# EAGLE design Circuit_Serial_3 (EAGLE 9.2.0)
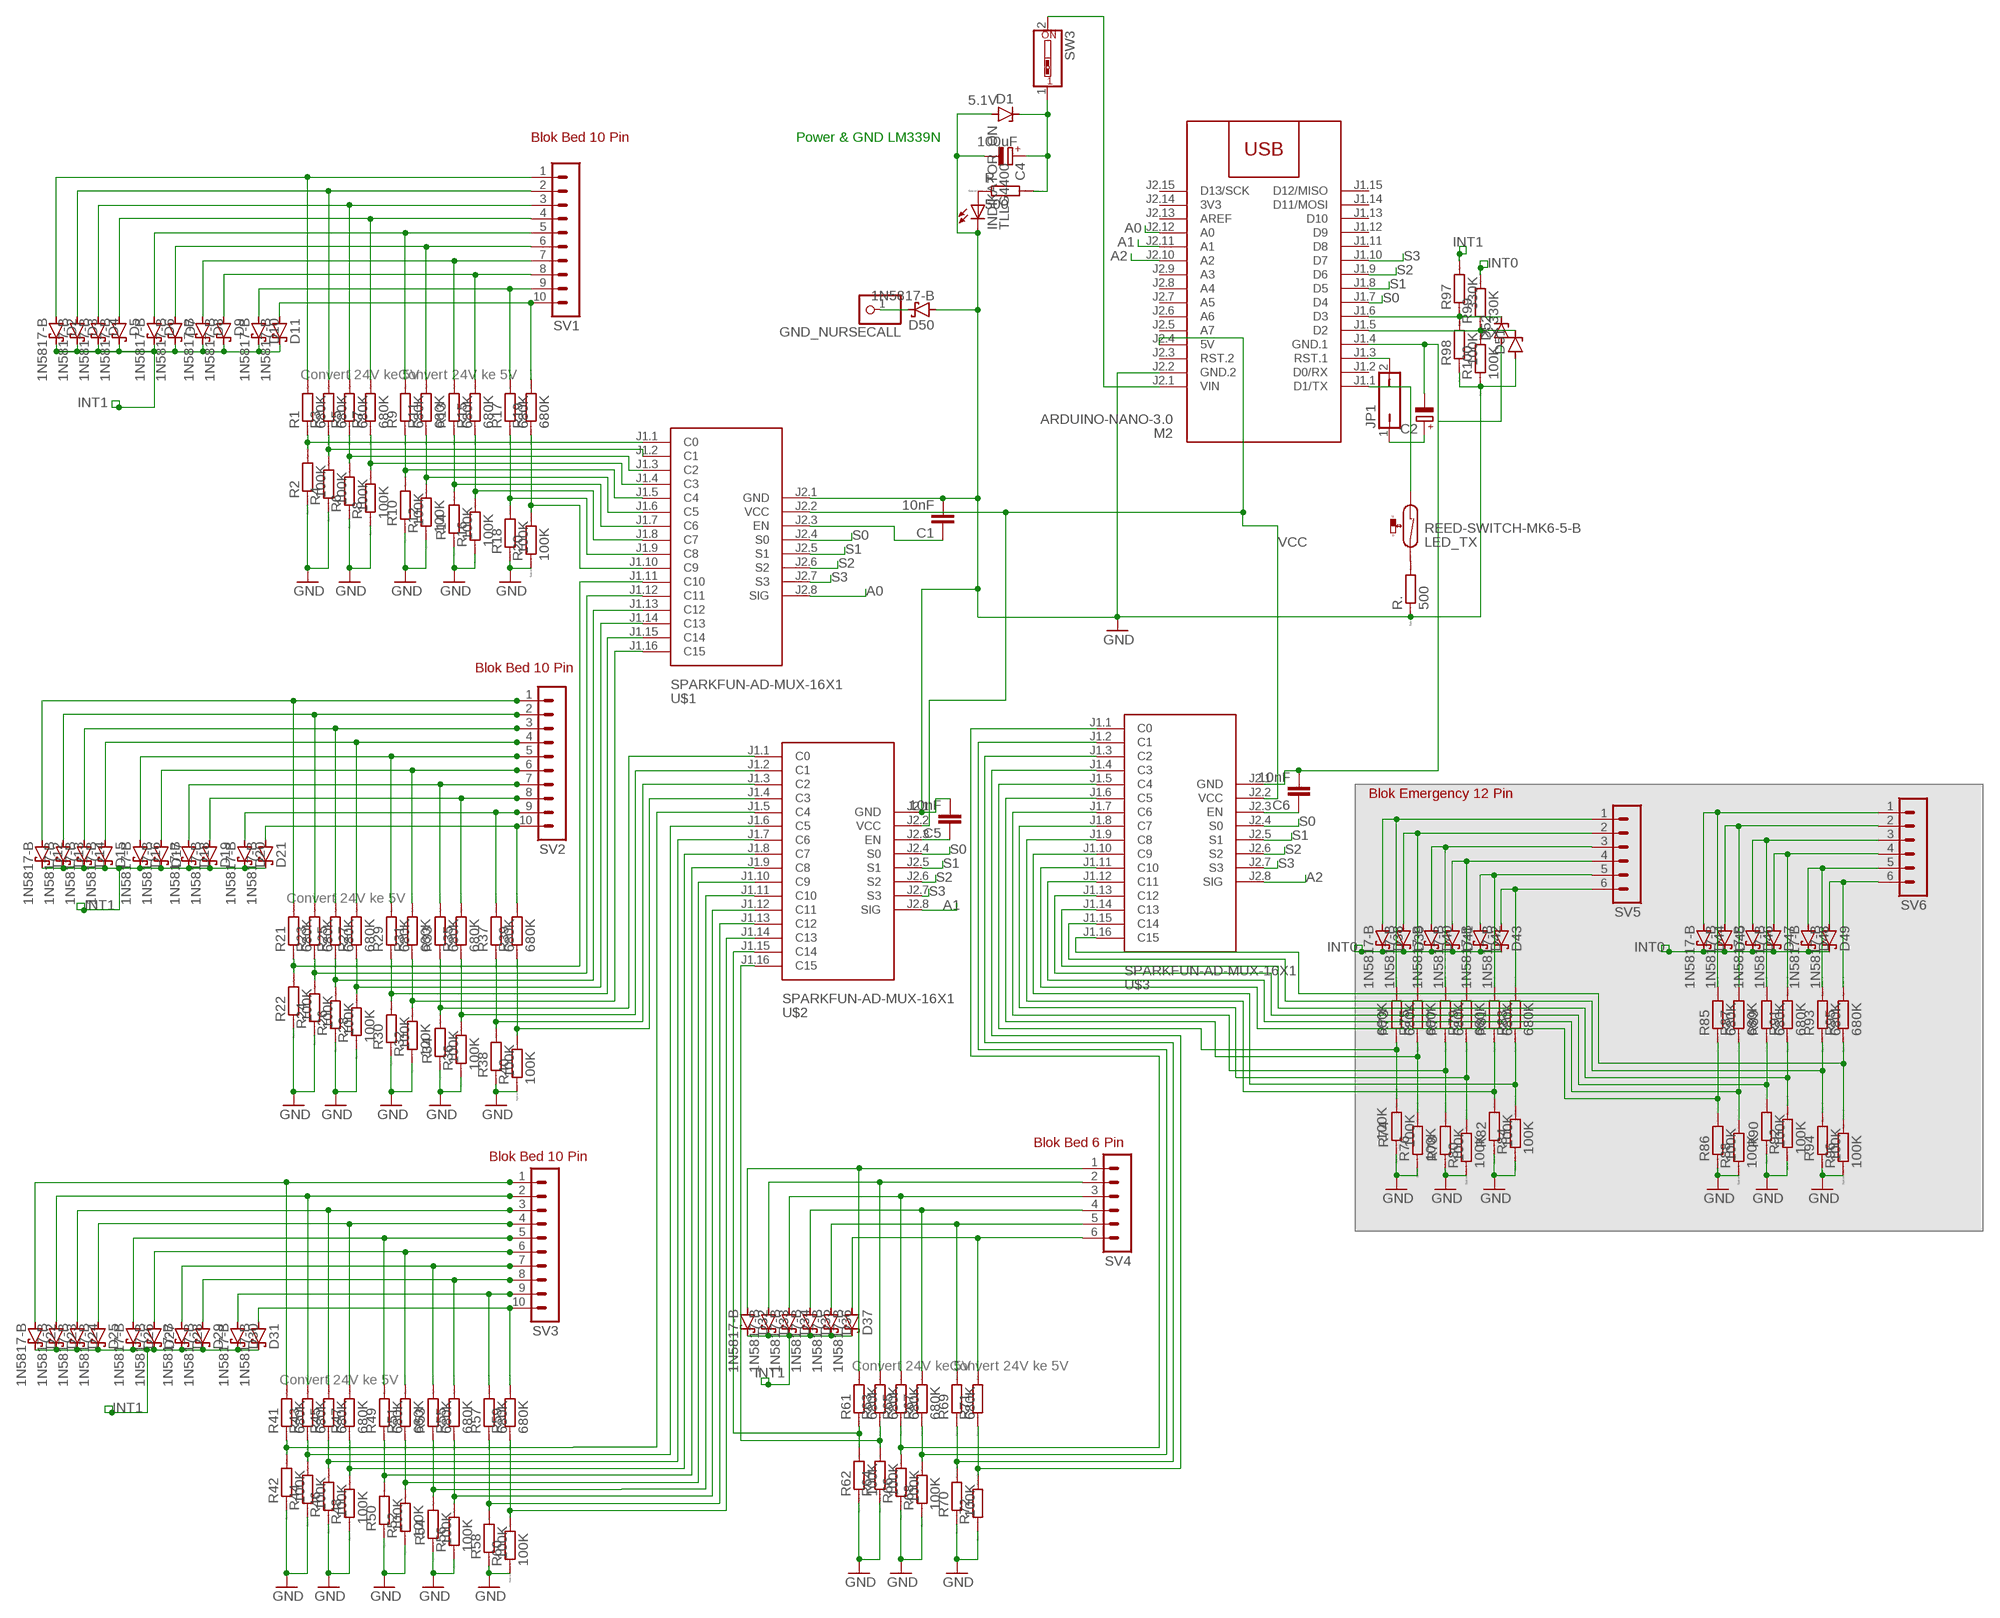
[diagram p0: schematic, sheet 1]

## Parts
C1  10nF  C-EU025-030X050  [C025-030X050]
C2  CPOL-EUE3.5-8  [E3,5-8]
C4  100uF  CPOL-EUE3.5-10  [E3,5-10]
C5  10nF  C-EU025-030X050  [C025-030X050]
C6  10nF  C-EU025-030X050  [C025-030X050]
D1  5.1V  ZENER-DIODEDO34-7  [DO34Z7]
D2  1N5817-B  [DO41-7.6]
D3  1N5817-B  [DO41-7.6]
D4  1N5817-B  [DO41-7.6]
D5  1N5817-B  [DO41-7.6]
D6  1N5817-B  [DO41-7.6]
D7  1N5817-B  [DO41-7.6]
D8  1N5817-B  [DO41-7.6]
D9  1N5817-B  [DO41-7.6]
D10  1N5817-B  [DO41-7.6]
D11  1N5817-B  [DO41-7.6]
D12  1N5817-B  [DO41-7.6]
D13  1N5817-B  [DO41-7.6]
D14  1N5817-B  [DO41-7.6]
D15  1N5817-B  [DO41-7.6]
D16  1N5817-B  [DO41-7.6]
D17  1N5817-B  [DO41-7.6]
D18  1N5817-B  [DO41-7.6]
D19  1N5817-B  [DO41-7.6]
D20  1N5817-B  [DO41-7.6]
D21  1N5817-B  [DO41-7.6]
D22  1N5817-B  [DO41-7.6]
D23  1N5817-B  [DO41-7.6]
D24  1N5817-B  [DO41-7.6]
D25  1N5817-B  [DO41-7.6]
D26  1N5817-B  [DO41-7.6]
D27  1N5817-B  [DO41-7.6]
D28  1N5817-B  [DO41-7.6]
D29  1N5817-B  [DO41-7.6]
D30  1N5817-B  [DO41-7.6]
D31  1N5817-B  [DO41-7.6]
D32  1N5817-B  [DO41-7.6]
D33  1N5817-B  [DO41-7.6]
D34  1N5817-B  [DO41-7.6]
D35  1N5817-B  [DO41-7.6]
D36  1N5817-B  [DO41-7.6]
D37  1N5817-B  [DO41-7.6]
D38  1N5817-B  [DO41-7.6]
D39  1N5817-B  [DO41-7.6]
D40  1N5817-B  [DO41-7.6]
D41  1N5817-B  [DO41-7.6]
D42  1N5817-B  [DO41-7.6]
D43  1N5817-B  [DO41-7.6]
D44  1N5817-B  [DO41-7.6]
D45  1N5817-B  [DO41-7.6]
D46  1N5817-B  [DO41-7.6]
D47  1N5817-B  [DO41-7.6]
D48  1N5817-B  [DO41-7.6]
D49  1N5817-B  [DO41-7.6]
D50  1N5817-B  [DO41-7.6]
D51  ZENER-DIODEDO34-7  [DO34Z7]
D52  ZENER-DIODEDO34-7  [DO34Z7]
GND_NURSECALL  PINHD-1X1  [1X01]
INDIKATOR_ON  TLLG4400  [LED3MM]
JP1  JP1Q  [JP1]
LED_TX  REED-SWITCH-MK6-5-B  [MK6-5]
M2  ARDUINO-NANO-3.0  [ARDUINO-NANO-3.0]
R  500  R0204/7  [0204/7]
R1  680K  R0204/7  [0204/7]
R2  100K  R0204/7  [0204/7]
R3  680K  R0204/7  [0204/7]
R4  100K  R0204/7  [0204/7]
R5  680K  R0204/7  [0204/7]
R6  100K  R0204/7  [0204/7]
R7  680K  R0204/7  [0204/7]
R8  100K  R0204/7  [0204/7]
R9  680K  R0204/7  [0204/7]
R10  100K  R0204/7  [0204/7]
R11  680K  R0204/7  [0204/7]
R12  100K  R0204/7  [0204/7]
R13  680K  R0204/7  [0204/7]
R14  100K  R0204/7  [0204/7]
R15  680K  R0204/7  [0204/7]
R16  100K  R0204/7  [0204/7]
R17  680K  R0204/7  [0204/7]
R18  100K  R0204/7  [0204/7]
R19  680K  R0204/7  [0204/7]
R20  100K  R0204/7  [0204/7]
R21  680K  R0204/7  [0204/7]
R22  100K  R0204/7  [0204/7]
R23  680K  R0204/7  [0204/7]
R24  100K  R0204/7  [0204/7]
R25  680K  R0204/7  [0204/7]
R26  100K  R0204/7  [0204/7]
R27  680K  R0204/7  [0204/7]
R28  100K  R0204/7  [0204/7]
R29  680K  R0204/7  [0204/7]
R30  100K  R0204/7  [0204/7]
R31  680K  R0204/7  [0204/7]
R32  100K  R0204/7  [0204/7]
R33  680K  R0204/7  [0204/7]
R34  100K  R0204/7  [0204/7]
R35  680K  R0204/7  [0204/7]
R36  100K  R0204/7  [0204/7]
R37  680K  R0204/7  [0204/7]
R38  100K  R0204/7  [0204/7]
R39  680K  R0204/7  [0204/7]
R40  100K  R0204/7  [0204/7]
R41  680K  R0204/7  [0204/7]
R42  100K  R0204/7  [0204/7]
R43  680K  R0204/7  [0204/7]
R44  100K  R0204/7  [0204/7]
R45  680K  R0204/7  [0204/7]
R46  100K  R0204/7  [0204/7]
R47  680K  R0204/7  [0204/7]
R48  100K  R0204/7  [0204/7]
R49  680K  R0204/7  [0204/7]
R50  100K  R0204/7  [0204/7]
R51  680K  R0204/7  [0204/7]
R52  100K  R0204/7  [0204/7]
R53  680K  R0204/7  [0204/7]
R54  100K  R0204/7  [0204/7]
R55  680K  R0204/7  [0204/7]
R56  100K  R0204/7  [0204/7]
R57  680K  R0204/7  [0204/7]
R58  100K  R0204/7  [0204/7]
R59  680K  R0204/7  [0204/7]
R60  100K  R0204/7  [0204/7]
R61  680K  R0204/7  [0204/7]
R62  100K  R0204/7  [0204/7]
R63  680K  R0204/7  [0204/7]
R64  100K  R0204/7  [0204/7]
R65  680K  R0204/7  [0204/7]
R66  100K  R0204/7  [0204/7]
R67  680K  R0204/7  [0204/7]
R68  100K  R0204/7  [0204/7]
R69  680K  R0204/7  [0204/7]
R70  100K  R0204/7  [0204/7]
R71  680K  R0204/7  [0204/7]
R72  100K  R0204/7  [0204/7]
R73  680K  R0204/7  [0204/7]
R74  100K  R0204/7  [0204/7]
R75  680K  R0204/7  [0204/7]
R76  100K  R0204/7  [0204/7]
R77  680K  R0204/7  [0204/7]
R78  100K  R0204/7  [0204/7]
R79  680K  R0204/7  [0204/7]
R80  100K  R0204/7  [0204/7]
R81  680K  R0204/7  [0204/7]
R82  100K  R0204/7  [0204/7]
R83  680K  R0204/7  [0204/7]
R84  100K  R0204/7  [0204/7]
R85  680K  R0204/7  [0204/7]
R86  100K  R0204/7  [0204/7]
R87  680K  R0204/7  [0204/7]
R88  100K  R0204/7  [0204/7]
R89  680K  R0204/7  [0204/7]
R90  100K  R0204/7  [0204/7]
R91  680K  R0204/7  [0204/7]
R92  100K  R0204/7  [0204/7]
R93  680K  R0204/7  [0204/7]
R94  100K  R0204/7  [0204/7]
R95  680K  R0204/7  [0204/7]
R96  100K  R0204/7  [0204/7]
R97  330K  R0204/7  [0204/7]
R98  100K  R0204/7  [0204/7]
R99  330K  R0204/7  [0204/7]
R100  100K  R0204/7  [0204/7]
R.  500  R0204/7  [0204/7]
SV1  MA10-1W  [MA10-1W]
SV2  MA10-1W  [MA10-1W]
SV3  MA10-1W  [MA10-1W]
SV4  MA06-1  [MA06-1]
SV5  MA06-1  [MA06-1]
SV6  MA06-1  [MA06-1]
SW3  SW_DIP-1  [EDG-01]
U$1  SPARKFUN-AD-MUX-16X1  [SPARKFUN-AD-MUX-16X1]
U$2  SPARKFUN-AD-MUX-16X1  [SPARKFUN-AD-MUX-16X1]
U$3  SPARKFUN-AD-MUX-16X1  [SPARKFUN-AD-MUX-16X1]

## Nets
A0: M2.J2.12(A0) U$1.J2.8(SIG)
A1: M2.J2.11(A1) U$2.J2.8(SIG)
A2: M2.J2.10(A2) U$3.J2.8(SIG)
GND: C1.2 C4.- C5.2 D1.A D50.A D51.A INDIKATOR_ON.K(C) M2.J2.2(GND.2) R2.1 R4.1 R6.1 R8.1 R10.1 R12.1 R14.1 R16.1 R18.1 R20.1 R22.1 R24.1 R26.1 R28.1 R30.1 R32.1 R34.1 R36.1 R38.1 R40.1 R42.1 R44.1 R46.1 R48.1 R50.1 R52.1 R54.1 R56.1 R58.1 R60.1 R62.1 R64.1 R66.1 R68.1 R70.1 R72.1 R74.1 R76.1 R78.1 R80.1 R82.1 R84.1 R86.1 R88.1 R90.1 R92.1 R94.1 R96.1 R98.1 R100.1 R..1 U$1.J2.1(GND) U$2.J2.1(GND)
INT0: D38.C D39.C D40.C D41.C D42.C D43.C D44.C D45.C D46.C D47.C D48.C D49.C R99.2
INT1: D2.C D3.C D4.C D5.C D6.C D7.C D8.C D9.C D10.C D11.C D12.C D13.C D14.C D15.C D16.C D17.C D18.C D19.C D20.C D21.C D22.C D23.C D24.C D25.C D26.C D27.C D28.C D29.C D30.C D31.C D32.C D33.C D34.C D35.C D36.C D37.C R97.2
N$1: D4.A R5.2 SV1.3
N$2: D2.A R1.2 SV1.1
N$3: D3.A R3.2 SV1.2
N$4: D11.A R19.2 SV1.10
N$5: D14.A R25.2 SV2.3
N$6: INDIKATOR_ON.A R.1
N$7: D12.A R21.2 SV2.1
N$8: R3.1 R4.2 U$1.J1.2(C1)
N$9: M2.J2.1(VIN) SW3.2
N$10: D15.A R27.2 SV2.4
N$11: D5.A R7.2 SV1.4
N$12: LED_TX.1 M2.J1.1(D1/TX)
N$13: R15.1 R16.2 U$1.J1.8(C7)
N$14: D18.A R33.2 SV2.7
N$15: D8.A R13.2 SV1.7
N$16: C5.1 U$2.J2.3(EN)
N$17: R17.1 R18.2 U$1.J1.9(C8)
N$18: D16.A R29.2 SV2.5
N$19: D17.A R31.2 SV2.6
N$20: R11.1 R12.2 U$1.J1.6(C5)
N$21: R19.1 R20.2 U$1.J1.10(C9)
N$22: R1.1 R2.2 U$1.J1.1(C0)
N$23: D6.A R9.2 SV1.5
N$24: R5.1 R6.2 U$1.J1.3(C2)
N$25: D19.A R35.2 SV2.8
N$26: D20.A R37.2 SV2.9
N$27: D7.A R11.2 SV1.6
N$28: D13.A R23.2 SV2.2
N$29: D21.A R39.2 SV2.10
N$30: D24.A R45.2 SV3.3
N$31: D22.A R41.2 SV3.1
N$32: R9.1 R10.2 U$1.J1.5(C4)
N$33: D25.A R47.2 SV3.4
N$34: R13.1 R14.2 U$1.J1.7(C6)
N$35: D28.A R53.2 SV3.7
N$36: R7.1 R8.2 U$1.J1.4(C3)
N$37: D9.A R15.2 SV1.8
N$38: D26.A R49.2 SV3.5
N$39: D10.A R17.2 SV1.9
N$40: D27.A R51.2 SV3.6
N$41: D29.A R55.2 SV3.8
N$42: D30.A R57.2 SV3.9
N$43: R31.1 R32.2 U$1.J1.16(C15)
N$44: R23.1 R24.2 U$1.J1.12(C11)
N$45: R35.1 R36.2 U$2.J1.2(C1)
N$46: R37.1 R38.2 U$2.J1.3(C2)
N$47: R39.1 R40.2 U$2.J1.4(C3)
N$48: R21.1 R22.2 U$1.J1.11(C10)
N$49: R25.1 R26.2 U$1.J1.13(C12)
N$50: R29.1 R30.2 U$1.J1.15(C14)
N$51: R33.1 R34.2 U$2.J1.1(C0)
N$52: R27.1 R28.2 U$1.J1.14(C13)
N$53: D23.A R43.2 SV3.2
N$54: D31.A R59.2 SV3.10
N$56: C6.1 U$3.J2.3(EN)
N$57: C1.1 U$1.J2.3(EN)
N$58: C2.- C6.2 D52.A M2.J1.4(GND.1) U$3.J2.1(GND)
N$59: LED_TX.2 R..2
N$60: D50.C GND_NURSECALL.1
N$61: C4.+ D1.C R.2 SW3.1
N$62: JP1.2 M2.J1.3(RST.1)
N$63: D52.C M2.J1.6(D3) R97.1 R98.2
N$64: C2.+ JP1.1
N$66: R63.1 R64.2 U$2.J1.16(C15)
N$67: R67.1 R68.2 U$3.J1.2(C1)
N$77: R51.1 R52.2 U$2.J1.10(C9)
N$78: R43.1 R44.2 U$2.J1.6(C5)
N$79: R55.1 R56.2 U$2.J1.12(C11)
N$80: R57.1 R58.2 U$2.J1.13(C12)
N$82: R59.1 R60.2 U$2.J1.14(C13)
N$83: R41.1 R42.2 U$2.J1.5(C4)
N$84: R45.1 R46.2 U$2.J1.7(C6)
N$85: R49.1 R50.2 U$2.J1.9(C8)
N$86: R53.1 R54.2 U$2.J1.11(C10)
N$87: R47.1 R48.2 U$2.J1.8(C7)
N$99: D46.A R89.2 SV6.3
N$100: D47.A R91.2 SV6.4
N$101: D34.A R65.2 SV4.3
N$102: D32.A R61.2 SV4.1
N$103: D35.A R67.2 SV4.4
N$104: D40.A R77.2 SV5.3
N$105: D36.A R69.2 SV4.5
N$106: D37.A R71.2 SV4.6
N$108: D41.A R79.2 SV5.4
N$109: D42.A R81.2 SV5.5
N$110: D33.A R63.2 SV4.2
N$111: R71.1 R72.2 U$3.J1.4(C3)
N$112: R73.1 R74.2 U$3.J1.5(C4)
N$113: R81.1 R82.2 U$3.J1.9(C8)
N$114: R85.1 R86.2 U$3.J1.11(C10)
N$115: R79.1 R80.2 U$3.J1.8(C7)
N$116: R61.1 R62.2 U$2.J1.15(C14)
N$117: R65.1 R66.2 U$3.J1.1(C0)
N$118: R69.1 R70.2 U$3.J1.3(C2)
N$119: R87.1 R88.2 U$3.J1.12(C11)
N$120: R89.1 R90.2 U$3.J1.13(C12)
N$121: D43.A R83.2 SV5.6
N$133: R75.1 R76.2 U$3.J1.6(C5)
N$134: R77.1 R78.2 U$3.J1.7(C6)
N$135: R91.1 R92.2 U$3.J1.14(C13)
N$136: D44.A R85.2 SV6.1
N$137: R83.1 R84.2 U$3.J1.10(C9)
N$140: R93.1 R94.2 U$3.J1.15(C14)
N$141: D45.A R87.2 SV6.2
N$146: D38.A R73.2 SV5.1
N$147: D39.A R75.2 SV5.2
N$148: D48.A R93.2 SV6.5
N$151: R95.1 R96.2 U$3.J1.16(C15)
N$153: D49.A R95.2 SV6.6
S0: M2.J1.7(D4) U$1.J2.4(S0) U$2.J2.4(S0) U$3.J2.4(S0)
S1: M2.J1.8(D5) U$1.J2.5(S1) U$2.J2.5(S1) U$3.J2.5(S1)
S2: M2.J1.9(D6) U$1.J2.6(S2) U$2.J2.6(S2) U$3.J2.6(S2)
S3: M2.J1.10(D7) U$1.J2.7(S3) U$2.J2.7(S3) U$3.J2.7(S3)
VCC: M2.J2.4(5V) U$1.J2.2(VCC) U$2.J2.2(VCC) U$3.J2.2(VCC)
XX: D51.C M2.J1.5(D2) R99.1 R100.2
Unconnected: M2.J1.2(D0/RX) M2.J1.11(D8) M2.J1.12(D9) M2.J1.13(D10) M2.J1.14(D11/MOSI) M2.J1.15(D12/MISO) M2.J2.3(RST.2) M2.J2.5(A7) M2.J2.6(A6) M2.J2.7(A5) M2.J2.8(A4) M2.J2.9(A3) M2.J2.13(AREF) M2.J2.15(D13/SCK)

## Notes on the sheet
- Blok Bed 10 Pin | Power & GND LM339N
- Convert 24V ke 5V | Convert 24V ke 5V
- Blok Bed 10 Pin
- Blok Emergency 12 Pin
- Convert 24V ke 5V
- Blok Bed 6 Pin
- Blok Bed 10 Pin
- Convert 24V ke 5V | Convert 24V ke 5V
- Convert 24V ke 5V

## Power pins joined to a net without a drawn wire
3V3: M2.J2.14(3V3)

## Library data of the parts
C1 C5 C6 = rcl:C-EU: CAPACITOR, European symbol; SPICEPREFIX: C
C2 C4 = rcl:CPOL-EU: POLARIZED CAPACITOR, European symbol; SPICEPREFIX: C
D1 D51 D52 = diode:ZENER-DIODE: Z-Diode
D2-D50 = diode:1N581*: 1.0A SCHOTTKY BARRIER RECTIFIER Source: http://www.diodes.com/datasheets/ds23001.pdf
GND_NURSECALL = pinhead:PINHD-1X1: PIN HEADER
INDIKATOR_ON = led:TLLG4400: Low Current (2mA) LED 3 mm Tinted Diffused Package color GREEN Source: Data sheet <http://www.farnell.com/datasheets/391098.pdf>; MF: VISHAY SEMICONDUCTOR; OC_FARNELL: 1612435
JP1 = jumper:JP1Q: JUMPER
LED_TX = switch-reed:REED-SWITCH-: Reed Sensor; MF: MEDER; MPN: MK6-5-B; OC_FARNELL: 1079479
M2 = diy-modules:ARDUINO-NANO-3.0: Arduino Nano 3.0 and compatible devices More details available here: https://www.arduino.cc/en/Main/ArduinoBoardNano Click here to find device on ebay.com <http://www.ebay.com/sch/arduino+nano>
R R1-R100 R. = eagle-ltspice:R: RESISTOR, European symbol; SPICEMODEL: NONE; SPICEPREFIX: R
SV1-SV3 = con-lstb:MA10-1W: PIN HEADER; OC_FARNELL: unknown; OC_NEWARK: unknown
SV4-SV6 = con-lstb:MA06-1: PIN HEADER; OC_FARNELL: unknown; OC_NEWARK: unknown
SW3 = special:SW_DIP-1: DIP SWITCH
U$1-U$3 = diy-modules:SPARKFUN-AD-MUX-16X1: SparkFun Analog/Digital MUX Breakout based on CD74HC4067 chip Source: https://www.sparkfun.com/products/9056

## Board
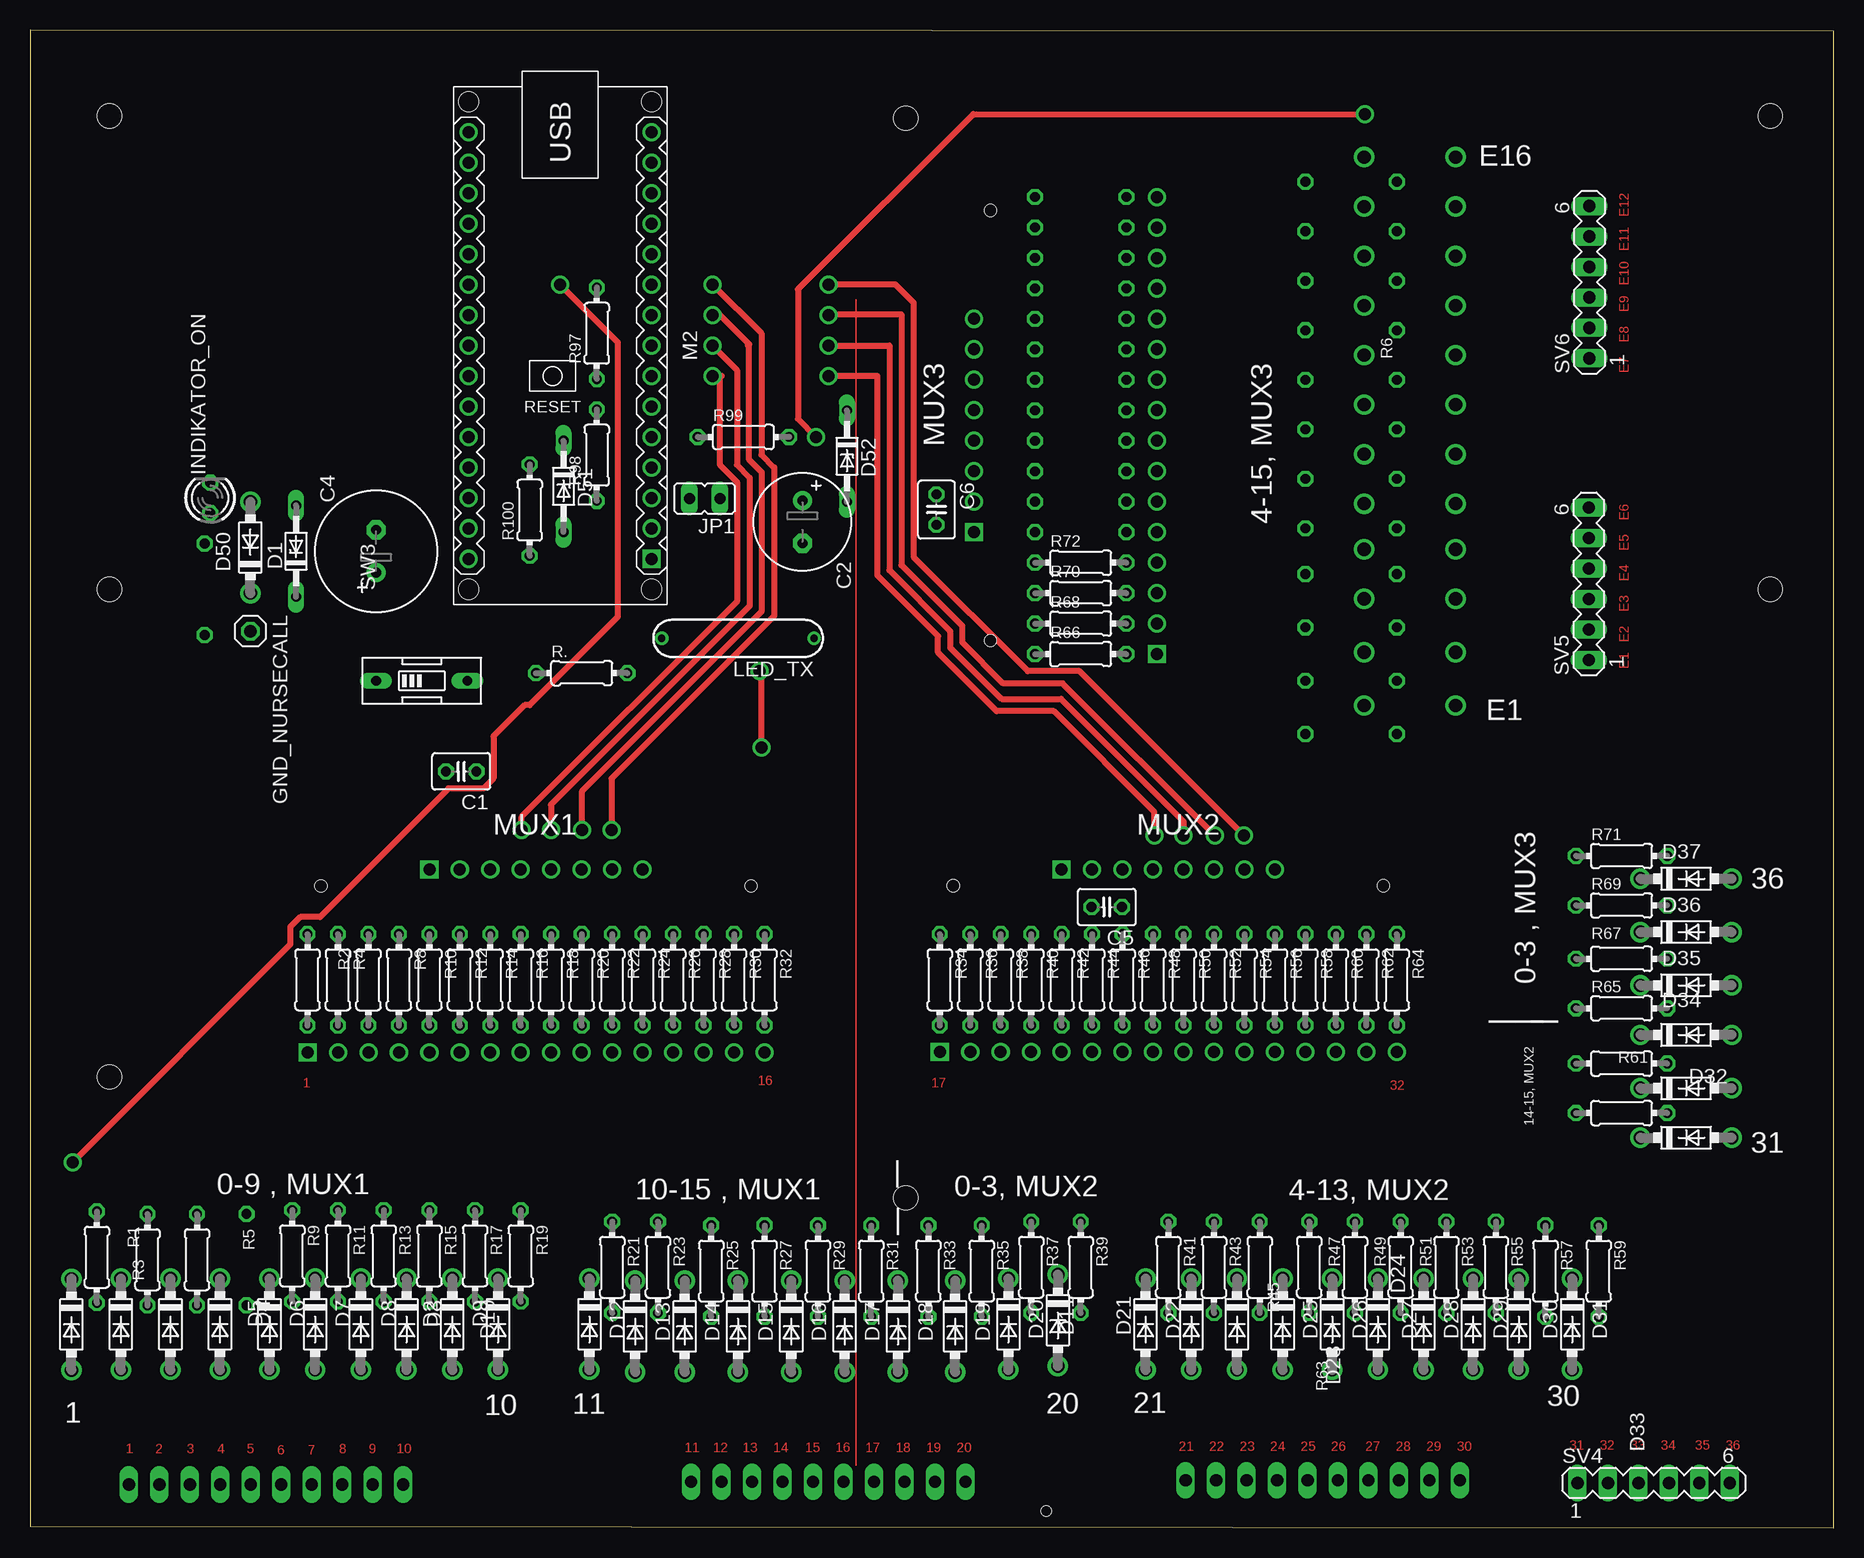
[diagram p1: board, top side]
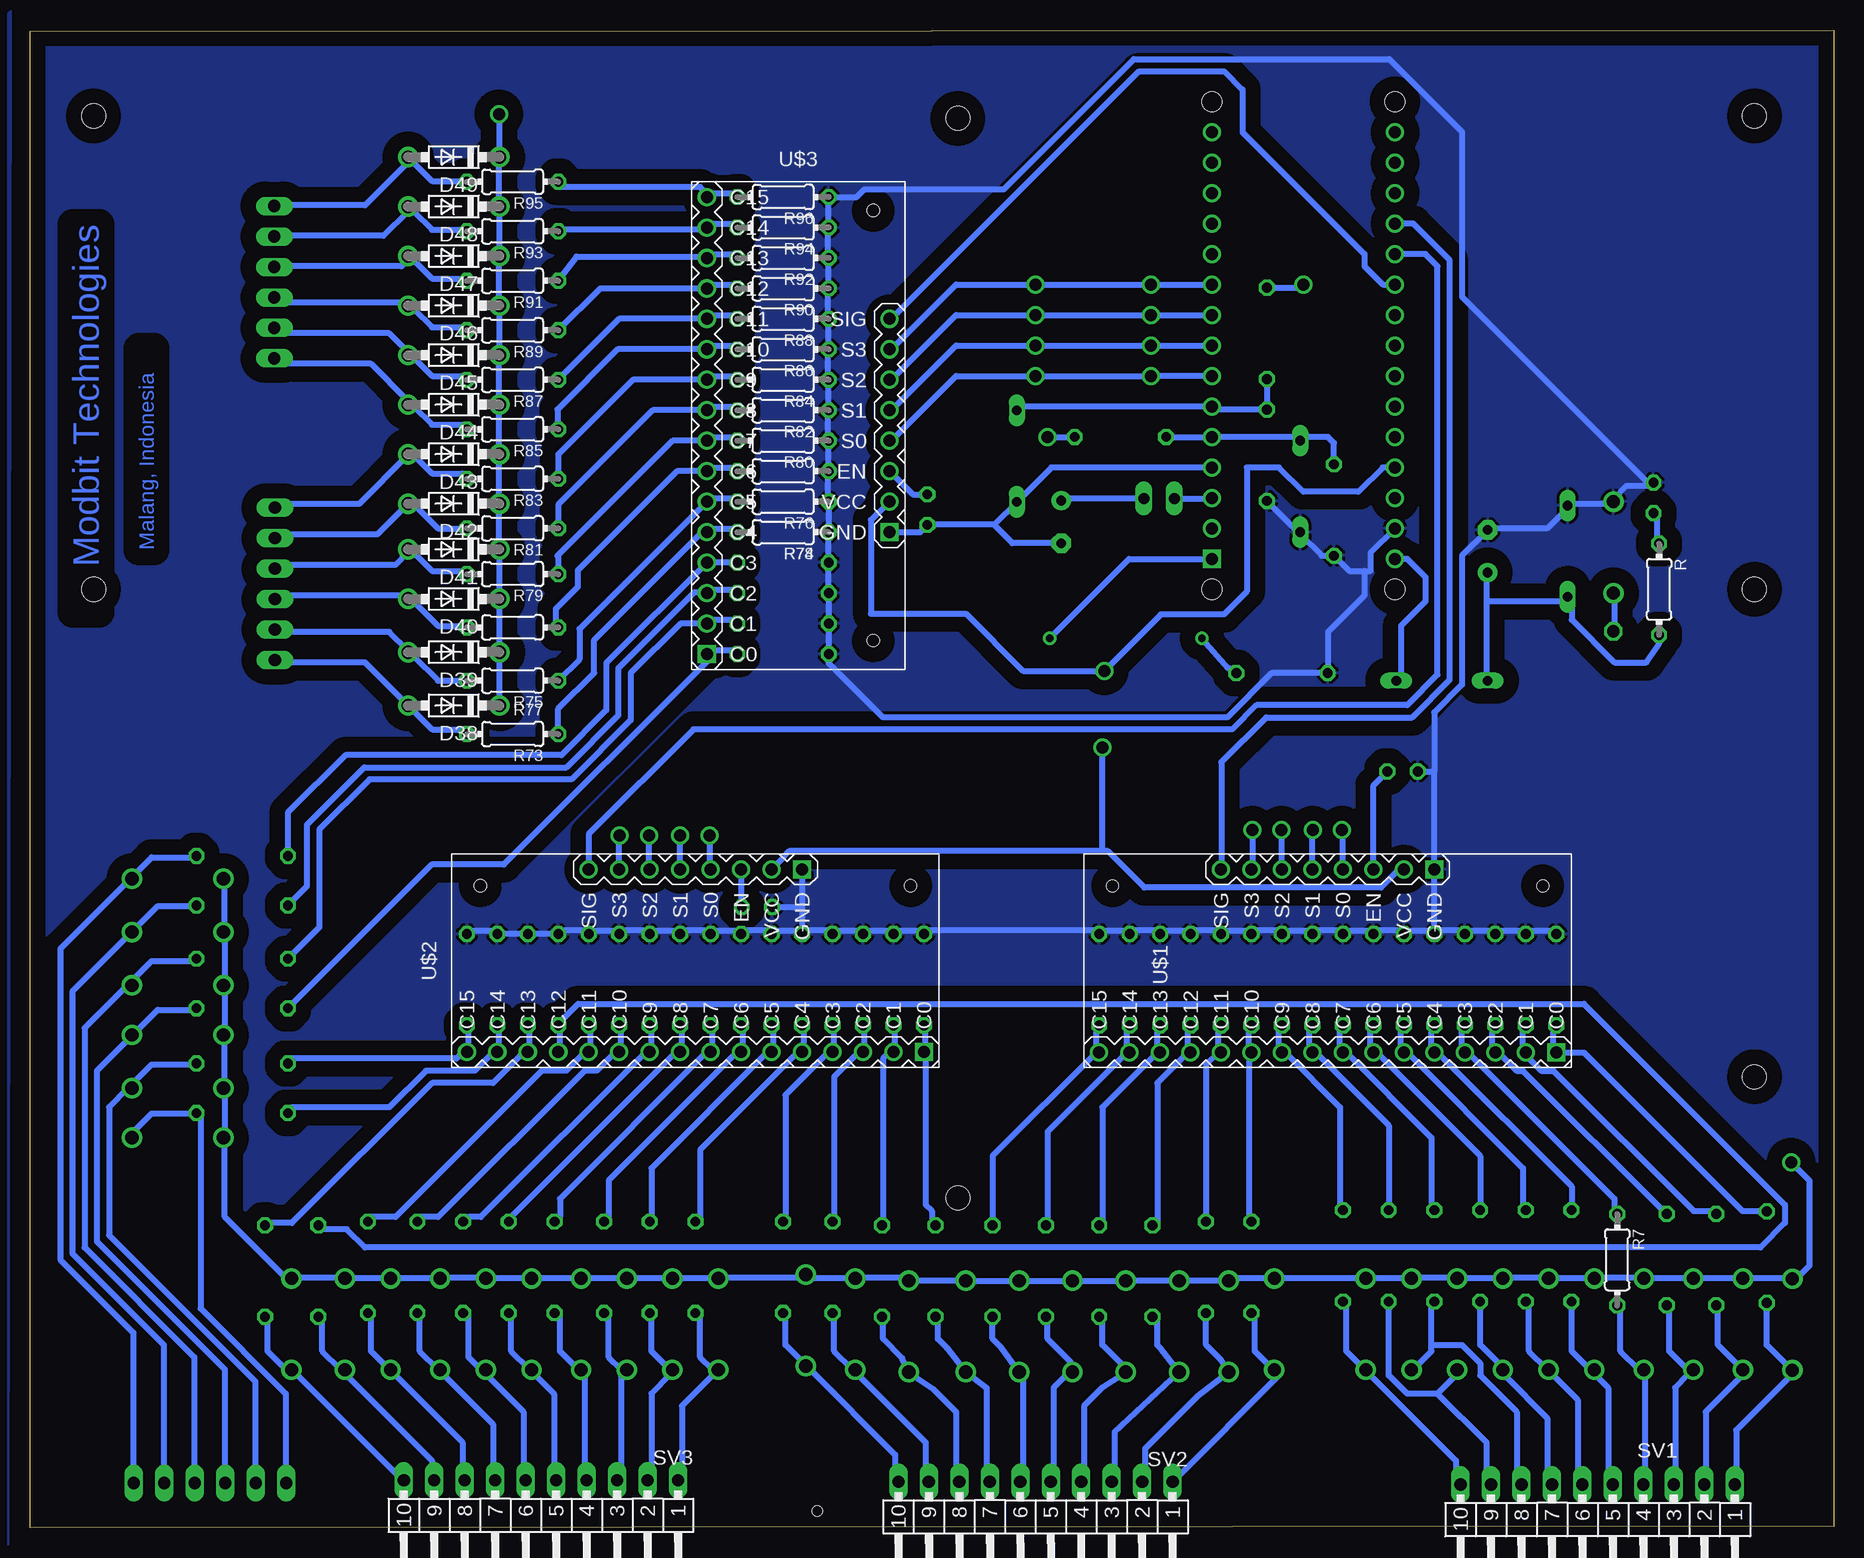
[diagram p2: board, bottom side, seen from below]

Size 150.35 x 124.84 mm. Coordinates in mm from the lower left corner, seen from the top.
Outline: 0,0.11 150.35,0 150.35,124.73 0,124.84 0,0.11
Copper layers (1*16): Top 0.035mm / dielectric 1.5mm / Bottom 0.035mm
Design rules "default *": minimum track width 20mil, minimum drill 0.35mm, track to track 20mil, track to pad 20mil, pad to pad 20mil, via to via 20mil, smd to smd 6mil, copper to edge 40mil, drill to drill 6mil, minimum pad ring 10mil, minimum via ring 8mil, stop-mask expansion 4mil, vias tented up to drill 0mil, thermal gap 10mil
Holes 0.85 mm at 84.72,1.38
Holes 2 mm at 145.05,78.22 145.05,117.67 6.62,117.67 6.62,78.22 6.62,37.58 73,117.48 73,27.48

### Footprints (pad centres in the part's own frame; a part is rotated, then mirrored left to right if it is on the bottom)
C025-030X050 = drill 0.813 octagon: 1 -1.27,0; 2 1.27,0
E3,5-8 = drill 0.813 pad 1.6: + -1.778,0 | drill 0.813 pad 1.6 octagon: - 1.778,0
E3,5-10 = drill 0.813 pad 1.6: + -1.778,0 | drill 0.813 pad 1.6 octagon: - 1.778,0
DO34Z7 = drill 0.813 long: A 3.81,0; C -3.81,0
DO41-7.6 = drill 1.1 pad 1.7: A 3.81,0; C -3.81,0
1X01 = drill 1.016 octagon: 1 0,0
LED3MM = drill 0.813 octagon: A -1.27,0; K 1.27,0
JP1 = drill 0.914 long: 1 0,-1.27; 2 0,1.27
MK6-5 = drill 0.6 pad 1.016: 1 -6.35,0; 2 6.35,0
ARDUINO-NANO-3.0 = drill 1 square: J1.1 17.78,7.62 | drill 1: J1.2 15.24,7.62; J1.3 12.7,7.62; J1.4 10.16,7.62; J1.5 7.62,7.62; J1.6 5.08,7.62; J1.7 2.54,7.62; J1.8 0,7.62; J1.9 -2.54,7.62; J1.10 -5.08,7.62; J1.11 -7.62,7.62; J1.12 -10.16,7.62; J1.13 -12.7,7.62; J1.14 -15.24,7.62; J1.15 -17.78,7.62; J2.1 17.78,-7.62; J2.2 15.24,-7.62; J2.3 12.7,-7.62; J2.4 10.16,-7.62; J2.5 7.62,-7.62; J2.6 5.08,-7.62; J2.7 2.54,-7.62; J2.8 0,-7.62; J2.9 -2.54,-7.62; J2.10 -5.08,-7.62; J2.11 -7.62,-7.62; J2.12 -10.16,-7.62; J2.13 -12.7,-7.62; J2.14 -15.24,-7.62; J2.15 -17.78,-7.62 | hole 1.651: -20.32,7.62; -20.32,-7.62; 20.32,-7.62; 20.32,7.62
0204/7 = drill 0.813 octagon: 1 -3.81,0; 2 3.81,0
MA10-1W = drill 1.016 long: 1 -11.43,0; 2 -8.89,0; 3 -6.35,0; 4 -3.81,0; 5 -1.27,0; 6 1.27,0; 7 3.81,0; 8 6.35,0; 9 8.89,0; 10 11.43,0
MA06-1 = drill 1.016 long: 1 -6.35,0; 2 -3.81,0; 3 -1.27,0; 4 1.27,0; 5 3.81,0; 6 6.35,0
EDG-01 = drill 0.813 long: 1 0,-3.81; 2 0,3.81
SPARKFUN-AD-MUX-16X1 = drill 1 square: J1.1 -7.62,-19.05; J2.1 7.62,-8.89 | drill 1: J1.2 -7.62,-16.51; J1.3 -7.62,-13.97; J1.4 -7.62,-11.43; J1.5 -7.62,-8.89; J1.6 -7.62,-6.35; J1.7 -7.62,-3.81; J1.8 -7.62,-1.27; J1.9 -7.62,1.27; J1.10 -7.62,3.81; J1.11 -7.62,6.35; J1.12 -7.62,8.89; J1.13 -7.62,11.43; J1.14 -7.62,13.97; J1.15 -7.62,16.51; J1.16 -7.62,19.05; J2.2 7.62,-6.35; J2.3 7.62,-3.81; J2.4 7.62,-1.27; J2.5 7.62,1.27; J2.6 7.62,3.81; J2.7 7.62,6.35; J2.8 7.62,8.89 | hole 1: 6.245,-17.93; 6.245,17.93

### Placement (x,y rotation side)
C1  35.95,63.04 180 top
C2  64.39,83.83 270 top
C4  28.84,81.39 90 top
C5  89.75,51.73 180 top
C6  75.55,84.86 270 top
D1  22.18,81.39 90 top
D2  3.45,16.93 270 top
D3  7.58,16.96 270 top
D4  11.71,16.96 270 top
D5  15.83,16.96 270 top
D6  19.96,16.96 270 top
D7  23.77,16.96 270 top
D8  27.58,16.96 270 top
D9  35.2,16.96 270 top
D10  31.39,16.96 270 top
D11  39.01,16.96 270 top
D12  46.63,16.96 270 top
D13  50.44,16.77 270 top
D14  54.57,16.77 270 top
D15  59.01,16.77 270 top
D16  63.46,16.77 270 top
D17  67.9,16.77 270 top
D18  72.35,16.77 270 top
D19  77.11,16.77 270 top
D20  81.56,16.96 270 top
D21  85.68,17.28 270 top
D22  92.98,16.96 270 top
D23  96.8,16.96 270 top
D24  100.61,16.96 270 top
D25  104.42,16.96 270 top
D26  108.54,16.96 270 top
D27  112.35,16.96 270 top
D28  116.16,16.96 270 top
D29  120.29,16.96 270 top
D30  124.1,16.96 270 top
D31  128.54,16.96 270 top
D32  138.04,32.5 0 top
D33  138.04,36.63 0 top
D34  138.04,41.07 0 top
D35  138.04,45.2 0 top
D36  138.04,49.65 0 top
D37  138.04,54.09 0 top
D38  115.02,68.53 180 bottom
D39  115.02,72.97 180 bottom
D40  115.02,77.42 180 bottom
D41  115.02,81.54 180 bottom
D42  115.02,85.35 180 bottom
D43  115.02,89.48 180 bottom
D44  115.02,93.61 180 bottom
D45  115.02,97.74 180 bottom
D46  115.02,101.86 180 bottom
D47  115.02,105.99 180 bottom
D48  115.02,110.12 180 bottom
D49  115.02,114.25 180 bottom
D50  18.37,81.71 90 top
D51  44.48,86.8 270 top
D52  68.1,89.32 270 top
GND_NURSECALL  18.37,74.72 270 top
INDIKATOR_ON  15.02,85.84 90 top
JP1  56.24,85.79 90 top
LED_TX  59.01,74.13 180 top
M2  44.2,98.54 270 top
R  14.56,78.22 270 bottom
R1  5.58,22.54 270 top
R2  23.13,45.67 270 top
R3  9.79,22.34 270 top
R4  25.67,45.67 270 top
R5  13.92,22.34 270 top
R6  28.21,45.67 270 top
R7  18.05,22.34 270 bottom
R8  30.75,45.67 270 top
R9  21.86,22.65 270 top
R10  33.29,45.67 270 top
R11  25.67,22.65 270 top
R12  35.83,45.67 270 top
R13  29.48,22.65 270 top
R14  38.37,45.67 270 top
R15  33.29,22.65 270 top
R16  40.91,45.67 270 top
R17  37.1,22.65 270 top
R18  43.45,45.67 270 top
R19  40.91,22.65 270 top
R20  45.99,45.67 270 top
R21  48.53,21.7 270 top
R22  48.53,45.67 270 top
R23  52.34,21.7 270 top
R24  51.07,45.67 270 top
R25  56.78,21.38 270 top
R26  53.61,45.67 270 top
R27  61.23,21.38 270 top
R28  56.15,45.67 270 top
R29  65.67,21.38 270 top
R30  58.69,45.67 270 top
R31  70.12,21.38 270 top
R32  61.23,45.67 270 top
R33  74.88,21.38 270 top
R34  75.83,45.67 270 top
R35  79.33,21.38 270 top
R36  78.38,45.67 270 top
R37  83.45,21.7 270 top
R38  80.92,45.67 270 top
R39  87.58,21.7 270 top
R40  83.45,45.67 270 top
R41  94.89,21.7 270 top
R42  86,45.67 270 top
R43  98.69,21.7 270 top
R44  88.53,45.67 270 top
R45  102.5,21.7 270 top
R46  91.08,45.67 270 top
R47  106.63,21.7 270 top
R48  93.61,45.67 270 top
R49  110.44,21.7 270 top
R50  96.16,45.67 270 top
R51  114.25,21.7 270 top
R52  98.69,45.67 270 top
R53  118.06,21.7 270 top
R54  101.23,45.67 270 top
R55  122.19,21.7 270 top
R56  103.78,45.67 270 top
R57  126.32,21.38 270 top
R58  106.31,45.67 270 top
R59  130.76,21.38 270 top
R60  108.86,45.67 270 top
R61  132.67,34.56 0 top
R62  111.39,45.67 270 top
R63  132.67,38.69 0 top
R64  113.94,45.67 270 top
R65  132.67,43.29 0 top
R66  87.58,72.82 0 top
R67  132.67,47.42 0 top
R68  87.58,75.36 0 top
R69  132.67,51.86 0 top
R70  87.58,77.9 0 top
R71  132.67,55.99 0 top
R72  87.58,80.44 0 top
R73  110.12,66.15 180 bottom
R74  87.58,82.98 180 bottom
R75  110.12,70.6 180 bottom
R76  87.58,85.52 180 bottom
R77  110.12,75.04 180 bottom
R78  87.58,88.06 180 bottom
R79  110.12,79.49 180 bottom
R80  87.58,90.6 180 bottom
R81  110.12,83.3 180 bottom
R82  87.58,93.14 180 bottom
R83  110.12,87.42 180 bottom
R84  87.58,95.68 180 bottom
R85  110.12,91.55 180 bottom
R86  87.58,98.22 180 bottom
R87  110.12,95.68 180 bottom
R88  87.58,100.76 180 bottom
R89  110.12,99.81 180 bottom
R90  87.58,103.3 180 bottom
R91  110.12,103.93 180 bottom
R92  87.58,105.84 180 bottom
R93  110.12,108.06 180 bottom
R94  87.58,108.38 180 bottom
R95  110.12,112.19 180 bottom
R96  87.58,110.92 180 bottom
R97  47.24,99.55 90 top
R98  47.24,89.39 90 top
R99  59.46,90.92 0 top
R100  41.66,84.82 90 top
R.  45.99,71.23 0 top
SV1  19.68,3.59 180 bottom
SV2  66.54,3.82 180 bottom
SV3  107.76,3.95 180 bottom
SV4  135.35,3.72 0 top
SV5  129.94,78.67 90 top
SV6  129.99,103.82 90 top
SW3  32.66,70.6 270 top
U$1  42.18,47.25 90 bottom
U$2  94.89,47.26 90 bottom
U$3  86.31,91.87 0 bottom

### Tracks (layer width: path | path; a pad name or v marks a point on that pad's centre or on a via)
A0
  Bottom 0.508: U$1.J2.8 51.04,54.9 51.04,63.8 47.3,67.55 35.14,67.55 32,70.68 32,105.65 35.05,108.7 M2.J2.12
A1
  Bottom 0.508: U$2.J2.8 103.78,57.8 95.05,66.53 50.14,66.53 48.11,68.56 35.56,68.56 33.02,71.1 33.02,105.14 34.04,106.16 M2.J2.11
A2
  Bottom 0.508: U$3.J2.8 78.23,101.08 57.91,121.4 50.8,121.4 49.28,119.87 49.28,116.32 39.12,106.16 39.12,105.14 37.59,103.62 M2.J2.10
GND
  Bottom 0.508: 39.12,79.74 39.12,77.71 42.16,74.66 42.16,71.61 R..1 46.88,71.23 50.56,67.55 79.25,67.55 83.82,72.12 83.77,72.17 R66.1 R68.1 R70.1 | M2.J2.2 38.61,81.26 38.61,79.74 39.12,79.74 | R76.1 83.82,85.33 83.77,85.28 | 83.82,80.25 83.82,78.22 R70.1 | 83.82,80.25 R72.1 83.82,80.76 | 83.82,77.71 R70.1 | R76.1 83.82,85.84 83.82,87.87 R78.1 83.82,88.38 83.82,90.41 R80.1 83.82,90.92 83.82,92.95 R82.1 83.82,93.46 83.82,95.49 R84.1 83.82,96 83.82,98.03 R86.1 83.82,98.54 83.82,100.57 R88.1 83.82,101.08 83.82,103.11 R90.1 83.82,103.62 83.82,105.65 R92.1 83.82,106.16 83.82,108.19 R94.1 83.82,108.7 83.82,110.73 R96.1 81.45,110.92 80.8,111.57 69.18,111.57 58.33,122.41 37.06,122.41 30.99,116.34 30.99,102.6 15.24,86.85 | R64.1 113.79,49.77 111.76,49.77 R62.1 111.25,49.77 110.97,49.48 R60.1 R58.1 | R58.1 106.68,49.77 106.17,49.77 | R42.1 86.36,49.77 88.39,49.77 R44.1 88.9,49.77 90.93,49.77 R46.1 91.44,49.77 93.47,49.77 R48.1 93.98,49.77 96.01,49.77 R50.1 96.52,49.77 98.55,49.77 R52.1 99.06,49.77 101.09,49.77 R54.1 101.6,49.77 103.63,49.77 R56.1 104.14,49.77 106.17,49.77 | 106.17,49.77 R58.1 | R42.1 85.85,49.77 83.82,49.77 R40.1 83.31,49.77 81.28,49.77 R38.1 80.77,49.77 78.74,49.77 R36.1 78.23,49.77 76.2,49.77 R34.1 75.69,49.77 61.47,49.77 R32.1 60.96,49.77 58.93,49.77 R30.1 58.42,49.77 56.39,49.77 R28.1 55.88,49.77 53.85,49.77 R26.1 53.34,49.77 51.31,49.77 R24.1 50.8,49.77 48.77,49.77 R22.1 48.26,49.77 46.23,49.77 R20.1 45.72,49.77 43.69,49.77 R18.1 43.18,49.77 41.15,49.77 R16.1 40.64,49.77 38.61,49.77 R14.1 | 15.24,86.85 17.27,86.85 18.29,85.84 D50.A 18.8,85.33 21.84,85.33 D1.A 22.35,84.82 23.88,83.3 28.45,83.3 C4.- 30.99,81.03 30.99,70.26 33.29,67.96 33.29,62.98
  Bottom 0.508: 15.24,86.85 INDIKATOR_ON.K | R2.1 23.37,49.77 25.4,49.77 R4.1 25.91,49.77 27.94,49.77 R6.1 28.45,49.77 30.48,49.77 R8.1 30.99,49.77 33.02,49.77 R10.1 | R14.1 38.1,49.77 36.07,49.77 R12.1 35.56,49.77 33.53,49.77 R10.1 | U$2.J2.1 86,51.8 | 86,51.8 R42.1 | 33.29,62.98 34.61,62.98 C1.2 | C5.2 86.07,51.73 86,51.8 | R14.1 38.37,49.79 | 39.12,79.74 40.39,79.74 R100.1 42.67,81.01 44.49,82.83 | R98.1 44.49,82.83 | R10.1 U$1.J2.1 33.29,62.98 | R76.1 R74.1 83.82,82.93 83.82,80.25 | D51.A 44.48,82.84 44.49,82.83
  pour Bottom (isolate 1.27): 152.17,-1.44 152.17,126.22 151.94,126.45
  pour Bottom (isolate 1.27): -1.63,126.04 -1.63,-0.52 0.28,-2.43 151,-2.43 152.1,-1.34 152.1,125.26 151.33,126.02 -1.57,126.02
INT0  (via drill 1)
  Top 0.508: v111.25,117.84 78.63,117.84 64.02,103.23 64.02,92.43 v65.53,90.92
  Bottom 0.508: D38.C 111.25,68.56 111.25,72.63 D39.C 111.25,73.14 111.25,77.2 D40.C 111.25,77.71 111.25,81.26 D41.C 111.25,81.77 111.25,85.33 D42.C 111.25,85.84 111.25,89.39 D43.C 111.25,89.9 111.25,93.46 D44.C 111.25,93.96 111.25,97.52 D45.C 111.25,98.03 111.25,101.58 D46.C 111.25,102.09 111.25,105.65 D47.C 111.25,106.16 111.25,109.71 D48.C 111.25,110.22 111.25,113.78 D49.C 111.25,114.28 v111.25,117.84 | v65.53,90.92 R99.2
INT1  (via drill 1)
  Top 0.508: v44.2,103.62 49,98.81 49,75.91 41.66,68.56 41.23,68.56 38.64,65.97 38.64,62.45 37.8,61.61 34.88,61.61 24.17,50.9 22.54,50.9 21.71,50.07 21.71,48.62 v3.56,30.46
  Bottom 0.508: D37.C 134.11,53.83 134.11,49.77 D36.C 134.11,49.26 134.11,45.7 D35.C 134.11,45.2 134.11,41.13 D34.C 134.11,40.62 134.11,37.07 D33.C 134.11,36.56 134.11,33 D32.C 134.11,32.5 134.11,25.89 129.03,20.81 D31.C 128.52,20.81 124.46,20.81 D30.C 123.95,20.81 120.4,20.81 D29.C 119.89,20.81 116.33,20.81 D28.C 115.82,20.81 112.78,20.81 D27.C 112.27,20.81 108.71,20.81 D26.C 108.2,20.81 104.65,20.81 D25.C 104.14,20.81 101.09,20.81 D24.C 100.58,20.81 97.03,20.81 D23.C 96.52,20.81 93.47,20.81 D22.C 92.96,20.81 85.85,20.81 D21.C 85.34,20.81 81.79,20.81 D20.C 81.28,20.81 77.2,20.81 D19.C D18.C D17.C D16.C D15.C D14.C D13.C 50.32,20.81 46.74,20.81 D12.C 46.23,20.81 39.12,20.81 D11.C 38.61,20.81 35.56,20.81 D9.C 35.05,20.81 31.5,20.81 D10.C 30.99,20.81 27.94,20.81 D8.C 27.43,20.81 23.88,20.81 D7.C 23.37,20.81 20.32,20.81 D6.C 19.81,20.81 16.26,20.81 D5.C 15.75,20.81 12.19,20.81 D4.C 11.68,20.81 7.62,20.81 D3.C 7.11,20.81 3.56,20.81 | 3.56,20.81 D2.C | v3.56,30.46 2.03,28.94 2.03,21.83 3.05,20.81 3.56,20.81 | R97.2 44.45,103.36 v44.2,103.62
N$1
  Bottom 0.508: R5.2 13.72,18.27 13.72,14.72 12.19,13.19 D4.A 12.19,12.68 13.21,11.67 13.21,4.05 SV1.3
N$2
  Bottom 0.508: R1.2 5.59,18.27 5.59,15.22 3.56,13.19 D2.A 3.56,12.68 8.13,8.11 8.13,4.05 SV1.1
N$3
  Bottom 0.508: R3.2 9.65,18.27 9.65,15.22 7.62,13.19 D3.A 7.62,12.68 10.67,9.64 10.67,4.05 SV1.2
N$4
  Bottom 0.508: R19.2 40.64,18.78 40.64,14.72 39.12,13.19 D11.A 38.61,12.68 31.5,5.57 31.5,4.05 SV1.10
N$5
  Bottom 0.508: R25.2 56.39,17.26 56.39,15.22 56.15,14.98 D14.A 59.94,7.95 59.94,4.05 SV2.3
N$6
  Bottom 0.508: R.1 14.73,82.28 14.73,84.31 INDIKATOR_ON.A
N$7
  Bottom 0.508: R21.2 48.26,17.76 48.26,14.72 46.74,13.19 D12.A 46.23,12.68 54.86,4.05 SV2.1
N$8
  Bottom 0.508: R3.1 10.16,26.4 11.68,26.4 23.37,38.08 24.38,38.08 25.91,39.61 U$1.J1.2 25.91,40.12 25.91,41.64 R4.2
N$9
  Bottom 0.508: SW3.2 36.07,70.6 36.07,75.17 34.04,77.2 34.04,79.23 35.56,80.76 M2.J2.1
N$10
  Bottom 0.508: R27.2 60.96,17.26 60.96,15.22 59.39,13.66 D15.A 60.9,11.73 62.48,10.14 62.48,4.05 SV2.4
N$11
  Bottom 0.508: R7.2 17.78,18.27 17.78,14.72 16.26,13.19 D5.A 15.75,12.68 15.75,4.05 SV1.4
N$12
  Bottom 0.508: LED_TX.1 58.73,80.76 M2.J1.1
N$13
  Bottom 0.508: R15.1 33.53,26.91 33.53,32.5 40.64,39.61 U$1.J1.8 41.15,40.12 41.15,41.64 R16.2
N$14
  Bottom 0.508: R33.2 74.68,17.26 74.68,15.73 73.92,14.98 D18.A 70.61,11.63 70.61,4.05 SV2.7
N$15
  Bottom 0.508: R13.2 29.46,18.78 29.46,15.22 27.43,13.19 D8.A 27.43,12.68 23.88,9.13 23.88,4.05 SV1.7
N$16
  Bottom 0.508: U$2.J2.3 91.08,51.78 C5.1
N$17
  Bottom 0.508: R17.1 37.08,26.91 37.08,33.51 43.18,39.61 U$1.J1.9 43.69,40.12 43.69,41.64 R18.2
N$18
  Bottom 0.508: R29.2 65.53,17.26 65.53,15.73 63.61,13.81 D16.A 63.78,12.91 65.02,11.67 65.02,4.05 SV2.5
N$19
  Bottom 0.508: R31.2 70.1,17.26 70.1,15.73 69.46,15.09 D17.A 67.56,12.68 67.56,4.05 SV2.6
N$20
  Bottom 0.508: R11.1 25.91,26.91 25.91,29.96 35.56,39.61 U$1.J1.6 36.07,40.12 36.07,41.64 R12.2
N$21
  Bottom 0.508: R19.1 41.15,26.91 41.15,35.04 45.72,39.61 U$1.J1.10 46.23,40.12 46.23,41.64 R20.2
N$22
  Bottom 0.508: R1.1 5.59,26.4 7.62,26.4 20.83,39.61 22.86,39.61 U$1.J1.1 23.37,40.12 23.37,41.64 R2.2
N$23
  Bottom 0.508: R9.2 21.84,18.78 21.84,14.72 20.32,13.19 D6.A 19.81,12.68 18.8,11.67 18.8,4.05 SV1.5
N$24
  Bottom 0.508: R5.1 14.22,26.4 25.91,38.08 26.42,38.08 27.94,39.61 U$1.J1.3 28.45,40.12 28.45,41.64 R6.2
N$25
  Bottom 0.508: R35.2 79.25,17.26 79.25,15.73 77.64,14.13 D19.A 75.08,11.57 73.15,9.64 73.15,4.05 SV2.8
N$26
  Bottom 0.508: R37.2 83.31,17.76 83.31,14.72 81.79,13.19 D20.A 81.28,12.68 75.69,7.1 75.69,4.05 SV2.9
N$27
  Bottom 0.508: R11.2 25.4,18.78 25.4,14.72 23.88,13.19 D7.A 23.37,12.68 21.34,10.65 21.34,4.05 SV1.6
N$28
  Bottom 0.508: R23.2 52.32,17.76 52.32,15.22 51.12,14.02 D13.A 52.99,11 57.4,6.59 57.4,4.05 SV2.2
N$29
  Bottom 0.508: R39.2 87.38,17.76 87.38,15.22 85.85,13.7 D21.A 85.34,13.19 78.23,6.08 78.23,4.05 SV2.10
N$30
  Bottom 0.508: R45.2 102.11,17.76 102.11,14.21 101.09,13.19 D24.A 101.09,12.68 101.09,4.05 SV3.3
N$31
  Bottom 0.508: R41.2 94.49,17.76 94.49,14.21 93.47,13.19 D22.A 93.47,12.68 96.01,10.14 96.01,4.05 SV3.1
N$32
  Bottom 0.508: R9.1 21.84,26.91 21.84,28.43 33.02,39.61 U$1.J1.5 33.53,40.12 33.53,41.64 R10.2
N$33
  Bottom 0.508: R47.2 106.17,17.76 106.17,14.72 104.65,13.19 D25.A 104.14,12.68 104.14,4.05 SV3.4
N$34
  Bottom 0.508: R13.1 29.46,26.91 29.46,30.97 38.1,39.61 U$1.J1.7 38.61,40.12 38.61,41.64 R14.2
N$35
  Bottom 0.508: R53.2 117.86,17.76 117.86,14.72 116.33,13.19 D28.A 115.82,12.68 111.76,8.62 111.76,4.05 SV3.7
N$36
  Bottom 0.508: R7.1 18.29,26.4 18.29,27.42 30.48,39.61 U$1.J1.4 30.99,40.12 30.99,41.64 R8.2
N$37
  Bottom 0.508: 33.53,15.22 33.53,14.72 35.05,13.19 D9.A | 33.53,15.22 33.53,18.78 R15.2 | 33.53,15.22 30.99,15.22 29.46,13.7 29.46,12.68 26.42,9.64 26.42,4.05 SV1.8
N$38
  Bottom 0.508: R49.2 110.24,17.76 110.24,14.72 108.71,13.19 D26.A 108.2,12.68 106.68,11.16 106.68,4.05 SV3.5
N$39
  Bottom 0.508: 33.02,11.16 35.56,11.16 37.08,12.68 37.08,18.78 R17.2 | 33.02,11.16 31.5,12.68 D10.A | 33.02,11.16 28.96,7.1 28.96,4.05 SV1.9
N$40
  Bottom 0.508: R51.2 113.79,17.76 113.79,14.21 112.78,13.19 D27.A 112.27,12.68 109.22,9.64 109.22,4.05 SV3.6
N$41
  Bottom 0.508: R55.2 121.92,17.76 121.92,14.72 120.4,13.19 D29.A 119.89,12.68 114.3,7.1 114.3,4.05 SV3.8
N$42
  Bottom 0.508: R57.2 125.98,17.26 125.98,14.72 124.46,13.19 D30.A 123.95,12.68 116.84,5.57 116.84,4.05 SV3.9
N$43
  Bottom 0.508: R32.2 61.47,41.64 61.47,40.12 U$1.J1.16 61.47,39.61 70.1,30.97 70.1,25.38 R31.1
N$44
  Bottom 0.508: R24.2 51.31,41.64 51.31,40.12 U$1.J1.12 51.31,39.61 52.32,38.59 52.32,25.89 R23.1
N$45
  Bottom 0.508: R36.2 78.23,41.64 78.23,40.12 U$2.J1.2 78.74,39.61 79.25,39.1 79.25,25.38 R35.1
N$46
  Bottom 0.508: R38.2 80.77,41.64 80.77,40.12 U$2.J1.3 81.28,39.61 83.31,37.58 83.31,25.89 R37.1
N$47
  Bottom 0.508: R40.2 83.31,41.64 83.31,40.12 U$2.J1.4 83.82,39.61 87.38,36.05 87.38,25.89 R39.1
N$48
  Bottom 0.508: R21.1 48.77,25.89 48.77,39.61 U$1.J1.11 48.77,40.12 48.77,41.64 R22.2
N$49
  Bottom 0.508: R26.2 53.85,41.64 53.85,40.12 U$1.J1.13 53.85,39.61 56.39,37.07 56.39,25.38 R25.1
N$50
  Bottom 0.508: R30.2 58.93,41.64 58.93,40.12 U$1.J1.15 58.93,39.61 65.53,33 65.53,25.38 R29.1
N$51
  Bottom 0.508: R33.1 75.18,25.38 75.18,26.4 75.69,26.91 75.69,39.61 U$2.J1.1 75.69,40.12 75.69,41.64 R34.2
N$52
  Bottom 0.508: R28.2 56.39,41.64 56.39,40.12 U$1.J1.14 56.39,39.61 60.96,35.04 60.96,25.38 R27.1
N$53
  Bottom 0.508: R43.2 98.55,17.76 98.55,14.72 97.03,13.19 D23.A 97.03,12.68 98.55,11.16 98.55,4.05 SV3.2
N$54
  Bottom 0.508: R59.2 130.56,17.26 130.56,14.72 129.03,13.19 D31.A 128.52,13.19 119.38,4.05 SV3.10
N$56
  Bottom 0.508: U$3.J2.3 76.77,86.13 C6.1
N$57
  Bottom 0.508: U$1.J2.3 38.37,61.88 C1.1
N$58
  Bottom 0.508: U$3.J2.1 76.17,82.98 C6.2 70.01,83.59 | M2.J1.4 65.23,88.38 D52.A 70.01,83.59 | C2.- 68.47,82.05 70.01,83.59
N$59
  Bottom 0.508: LED_TX.2 50.46,71.61 50.29,71.61 R..2
N$60
  Bottom 0.508: GND_NURSECALL.1 18.29,75.17 18.29,77.71 D50.C
N$61
  Bottom 0.508: 28.96,77.2 28.96,79.23 C4.+ | 28.96,77.2 28.96,70.6 SW3.1 | R.2 14.56,73.67 15.62,72.12 18.29,72.12 21.84,75.68 21.84,77.2 D1.C 22.35,77.2 28.96,77.2
N$62
  Bottom 0.508: JP1.2 51.87,85.78 M2.J1.3
N$63
  Bottom 0.508: R97.1 R98.2 51.56,93.2 M2.J1.6 67.77,93.46 D52.C
N$64
  Bottom 0.508: JP1.1 64.21,85.78 C2.+
N$66
  Bottom 0.508: R64.2 113.79,41.64 113.79,40.12 U$2.J1.16 114.3,39.61 114.81,39.1 128.52,39.1 R63.1
N$67
  Bottom 0.508: R68.2 91.44,75.68 93.47,75.68 U$3.J1.2 96.14,75.36 100.28,71.22 100.28,67.3 105.21,62.37 122.06,62.37 126.24,58.19 126.24,50.04 R67.1
N$77
  Bottom 0.508: R52.2 98.55,41.64 98.55,40.12 U$2.J1.10 99.06,39.61 112.78,25.89 113.79,25.89 R51.1
N$78
  Bottom 0.508: R44.2 88.39,41.64 88.39,40.12 U$2.J1.6 88.9,39.61 98.55,29.96 98.55,25.89 R43.1
N$79
  Bottom 0.508: R56.2 103.63,41.64 103.63,40.12 U$2.J1.12 104.14,39.61 105.66,38.08 107.7,38.08 119.89,25.89 121.92,25.89 R55.1
N$80
  Bottom 0.508: U$2.J1.13 106.17,40.12 106.17,41.64 R58.2 106.17,42.15 104.65,43.67 20.83,43.67 4.06,26.91 4.06,25.38 6.1,23.35 122.43,23.35 123.95,24.88 125.98,24.88 R57.1
N$82
  Bottom 0.508: R60.2 108.71,41.64 108.71,40.12 U$2.J1.14 109.22,39.61 111.76,37.07 116.84,37.07 128.52,25.38 130.56,25.38 R59.1
N$83
  Bottom 0.508: R42.2 85.85,41.64 85.85,40.12 U$2.J1.5 86.36,39.61 94.49,31.48 94.49,25.89 R41.1
N$84
  Bottom 0.508: R46.2 90.93,41.64 90.93,40.12 U$2.J1.7 91.44,39.61 102.11,28.94 102.11,25.89 R45.1
N$85
  Bottom 0.508: R50.2 96.01,41.64 96.01,40.12 U$2.J1.9 96.52,39.61 110.24,25.89 R49.1
N$86
  Bottom 0.508: R54.2 101.09,41.64 101.09,40.12 U$2.J1.11 101.6,39.61 103.12,38.08 104.14,38.08 116.33,25.89 117.86,25.89 R53.1
N$87
  Bottom 0.508: R47.1 106.17,25.89 106.17,27.42 93.98,39.61 U$2.J1.8 93.47,40.12 93.47,41.64 R48.2
N$99
  Bottom 0.508: R89.2 114.3,100.06 116.84,100.06 118.36,101.58 D46.A 118.87,102.09 129.54,102.09 SV6.3
N$100
  Bottom 0.508: R91.2 114.3,104.12 116.84,104.12 118.36,105.65 D47.A 118.87,105.65 119.38,105.14 129.54,105.14 SV6.4
N$101
  Bottom 0.508: R65.2 136.65,43.16 139.7,43.16 141.73,41.13 D34.A 142.24,40.62 144.78,38.08 144.78,23.86 134.11,13.19 134.11,4.05 SV4.3
N$102
  Bottom 0.508: D32.A 141.73,33 140.21,34.53 136.65,34.53 R61.2 136.14,34.53 136.14,18.27 129.03,11.16 129.03,4.05 SV4.1
N$103
  Bottom 0.508: R67.2 136.65,47.23 140.21,47.23 141.73,45.7 D35.A 142.24,45.2 145.8,41.64 145.8,23.35 136.65,14.21 136.65,4.05 SV4.4
N$104
  Bottom 0.508: R77.2 114.3,75.17 116.33,75.17 118.36,77.2 D40.A 118.87,77.71 129.54,77.71 SV5.3
N$105
  Bottom 0.508: R69.2 136.65,51.8 139.7,51.8 141.73,49.77 D36.A 142.24,49.26 146.81,44.69 146.81,22.84 139.19,15.22 139.19,4.05 SV4.5
N$106
  Bottom 0.508: R71.2 136.65,55.86 140.21,55.86 141.73,54.34 D37.A 142.24,53.83 147.83,48.24 147.83,22.34 141.73,16.24 141.73,4.05 SV4.6
N$108
  Bottom 0.508: R79.2 114.3,79.74 116.84,79.74 118.36,81.26 D41.A 118.87,81.26 119.89,80.25 129.54,80.25 SV5.4
N$109
  Bottom 0.508: R81.2 116.33,83.3 118.36,85.33 D42.A 118.87,85.33 121.41,82.79 129.54,82.79 SV5.5
N$110
  Bottom 0.508: R63.2 136.65,38.59 140.21,38.59 141.73,37.07 D33.A 142.24,36.56 143.76,35.04 143.76,24.37 131.57,12.18 131.57,4.05 SV4.2
N$111
  Bottom 0.508: R72.2 U$3.J1.4 102.31,72.06 102.31,68.14 106.06,64.4 124.05,64.4 128.86,59.59 R71.1
N$112
  Bottom 0.508: R74.2 91.44,83.3 93.47,83.3 U$3.J1.5 94.35,82.98 103.33,74 103.33,71.26 106.31,68.27 R73.1
N$113
  Bottom 0.508: R82.2 91.44,93.46 93.47,93.46 U$3.J1.9 98.45,93.14 106.31,85.28 R81.1
N$114
  Bottom 0.508: R86.2 91.44,98.54 93.47,98.54 U$3.J1.11 101.36,98.22 106.38,93.2 106.38,91.61 R85.1
N$115
  Bottom 0.508: R80.2 91.44,90.92 93.47,90.92 U$3.J1.8 96.79,90.6 106.38,81.01 106.31,80.95 R79.1
N$116
  Bottom 0.508: R62.2 111.25,41.64 111.25,40.12 U$2.J1.15 111.76,39.61 113.28,38.08 117.35,38.08 120.4,35.04 128.52,35.04 R61.1
N$117
  Bottom 0.508: R66.2 91.44,73.14 93.47,73.14 U$3.J1.1 93.93,72.21 110.87,55.27 116.88,55.27 R65.1
N$118
  Bottom 0.508: R70.2 91.44,78.22 93.47,78.22 93.69,78.06 | 93.69,78.06 U$3.J1.3 | R69.1 127.25,53.47 127.25,58.61 122.48,63.38 105.64,63.38 101.3,67.72 101.3,71.64 94.96,77.97 93.78,77.97 93.69,78.06
N$119
  Bottom 0.508: R88.2 91.44,101.08 93.47,101.08 U$3.J1.12 101.23,100.76 R87.1
N$120
  Bottom 0.508: R90.2 91.44,103.62 93.47,103.62 U$3.J1.13 102.82,103.3 R89.1
N$121
  Bottom 0.508: R83.2 114.3,87.87 116.84,87.87 118.36,89.39 D43.A 118.87,89.39 122.94,85.33 129.54,85.33 SV5.6
N$133
  Bottom 0.508: R76.2 91.44,85.84 93.47,85.84 U$3.J1.6 104.55,74.91 104.55,72.36 R75.1
N$134
  Bottom 0.508: R78.2 91.44,88.38 93.47,88.38 U$3.J1.7 96.43,88.06 104.7,79.79 104.7,78.42 106.53,76.59 106.53,75.25 R77.1
N$135
  Bottom 0.508: R91.1 104.8,105.95 94.05,105.95 U$3.J1.14 93.47,106.16 91.44,106.16 R92.2
N$136
  Bottom 0.508: R85.2 114.3,91.93 116.84,91.93 118.36,93.46 D44.A 118.87,93.96 121.92,97.01 129.54,97.01 SV6.1
N$137
  Bottom 0.508: R84.2 91.44,96 93.47,96 U$3.J1.10 100.09,95.68 106.31,89.45 R83.1
N$140
  Bottom 0.508: R93.1 106.17,108.19 93.98,108.19 U$3.J1.15 93.47,108.7 91.44,108.7 R94.2
N$141
  Bottom 0.508: R87.2 114.3,96 116.84,96 118.36,97.52 D45.A 118.87,98.03 120.4,99.55 129.54,99.55 SV6.2
N$146
  Bottom 0.508: R73.2 114.3,66.53 116.84,66.53 118.36,68.06 D38.A 118.87,68.56 122.43,72.12 129.54,72.12 SV5.1
N$147
  Bottom 0.508: R75.2 116.33,70.6 118.36,72.63 D39.A 118.87,73.14 120.4,74.66 129.54,74.66 SV5.2
N$148
  Bottom 0.508: R93.2 114.3,108.19 116.84,108.19 118.36,109.71 D48.A 118.87,109.71 120.9,107.68 129.54,107.68 SV6.5
N$151
  Bottom 0.508: R96.2 91.44,111.24 93.47,111.24 U$3.J1.16 93.98,111.24 94.49,111.74 106.17,111.74 R95.1
N$153
  Bottom 0.508: R95.2 114.3,112.25 116.84,112.25 118.36,113.78 D49.A 118.87,113.78 122.43,110.22 129.54,110.22 SV6.6
S0  (via drill 1)
  Top 0.508: 57.68,96 57.53,96 | 57.53,96 v56.9,96 | v93.73,57.69 93.73,59.67 85.34,68.06 80.57,68.06 75.69,72.94 75.69,74.31 70.61,79.39 70.61,96 v66.55,96 | v41,58.15 41,59.27 58.98,77.25 58.98,87.11 57.53,88.55 57.53,96
  Bottom 0.508: U$3.J2.4 78.23,90.92 73.15,96 v66.55,96 v56.9,96 M2.J1.7 | U$2.J2.4 93.73,54.99 v93.73,57.69 | U$1.J2.4 40.91,58.07 v41,58.15
S1  (via drill 1)
  Top 0.508: v66.55,98.54 71.63,98.54 71.63,79.81 76.71,74.73 76.71,73.36 80.99,69.07 85.94,69.07 96.16,58.85 v96.16,57.69 | v56.9,98.54 58.93,96.5 58.93,88.59 59.99,87.53 59.99,76.83 43.43,60.27 v43.43,58.15
  Bottom 0.508: U$3.J2.5 78.23,93.46 73.15,98.54 v66.55,98.54 v56.9,98.54 M2.J1.8 | U$1.J2.5 43.45,58.13 v43.43,58.15 | U$2.J2.5 96.16,57.68 v96.16,57.69
S2  (via drill 1)
  Top 0.508: 59.94,98.64 57.51,101.08 v56.9,101.08 | v98.75,57.69 86.07,70.38 81.12,70.38 77.72,73.78 77.72,75.15 72.64,80.23 72.64,101.12 67.1,101.12 67.06,101.08 v66.55,101.08 | 59.84,98.54 59.94,98.64 | 59.94,98.64 59.94,89.02 61.01,87.95 61.01,76.41 46.02,61.42 v46.02,58.15
  Bottom 0.508: U$3.J2.6 78.23,96 73.15,101.08 v66.55,101.08 v56.9,101.08 M2.J1.9 | U$2.J2.6 98.75,54.94 v98.75,57.69 | U$1.J2.6 45.99,58.12 v46.02,58.15
S3  (via drill 1)
  Top 0.508: v48.46,58.15 48.46,62.42 62.03,75.99 62.03,88.37 60.96,89.44 60.96,99.55 v56.9,103.62 | v101.19,57.69 87.49,71.4 83.18,71.4 73.66,80.92 73.66,102.09 72.14,103.62 v66.55,103.62
  Bottom 0.508: U$3.J2.7 78.23,98.54 73.15,103.62 v66.55,103.62 v56.9,103.62 M2.J1.10 | U$1.J2.7 48.46,54.94 v48.46,58.15 | U$2.J2.7 101.23,57.65 v101.19,57.69
VCC  (via drill 1)
  Top 0.508: v60.96,65.01 60.96,71.26 v60.81,71.41
  Bottom 0.508: U$3.J2.2 79.72,84.5 79.76,84.5 80.26,83.99 80.26,76.18 72.34,76.18 67.56,71.41 v60.81,71.41 56.1,76.12 50.84,76.12 48.92,78.04 48.92,88.38 46.23,88.38 44.2,86.34 39.62,86.34 37.59,88.38 M2.J2.4 | U$2.J2.2 87.51,55.9 87.51,55.95 87.06,56.39 60.96,56.39 | 60.96,56.39 60.51,56.39 57.47,53.35 37.74,53.35 36.23,54.87 U$1.J2.2 | 60.96,56.39 v60.96,65.01
XX
  Bottom 0.508: R100.2 41.66,90.41 42.16,90.92 44.4,90.92 | R99.1 M2.J1.5 44.4,90.92 | D51.C 44.48,90.84 44.4,90.92
(copper drawn outside any net)
  shapes: Top area x1

### Text on the board
Top: E12 | E11 | E10 | E9 | E8 | E7 | E6 | E5 | E4 | E3 | E2 | E1 | 1 | 16 | 17 | 32 | 1 | 2 | 3 | 4 | 5 | 6 | 7 | 8 | 9 | 10 | 11 | 12 | 13 | 14 | 15 | 16 | 17 | 18 | 19 | 20 | 21 | 22 | 23 | 24 | 25 | 26 | 27 | 28 | 29 | 30 | 31 | 32 | 33 | 34 | 35 | 36
Bottom: Modbit Technologies | Malang, Indonesia
tPlace: E16 | MUX3 | 4-15, MUX3 | E1 | MUX1 | MUX2 | 36 | 0-3 , MUX3 | | | | | | | 14-15, MUX2 | 31 | | | 0-9 , MUX1 | 10-15 , MUX1 | 0-3, MUX2 | 4-13, MUX2 | | | 30 | 10 | 11 | 20 | 21 | 1